# EAGLE design TRI_LED (EAGLE 7.0.0)
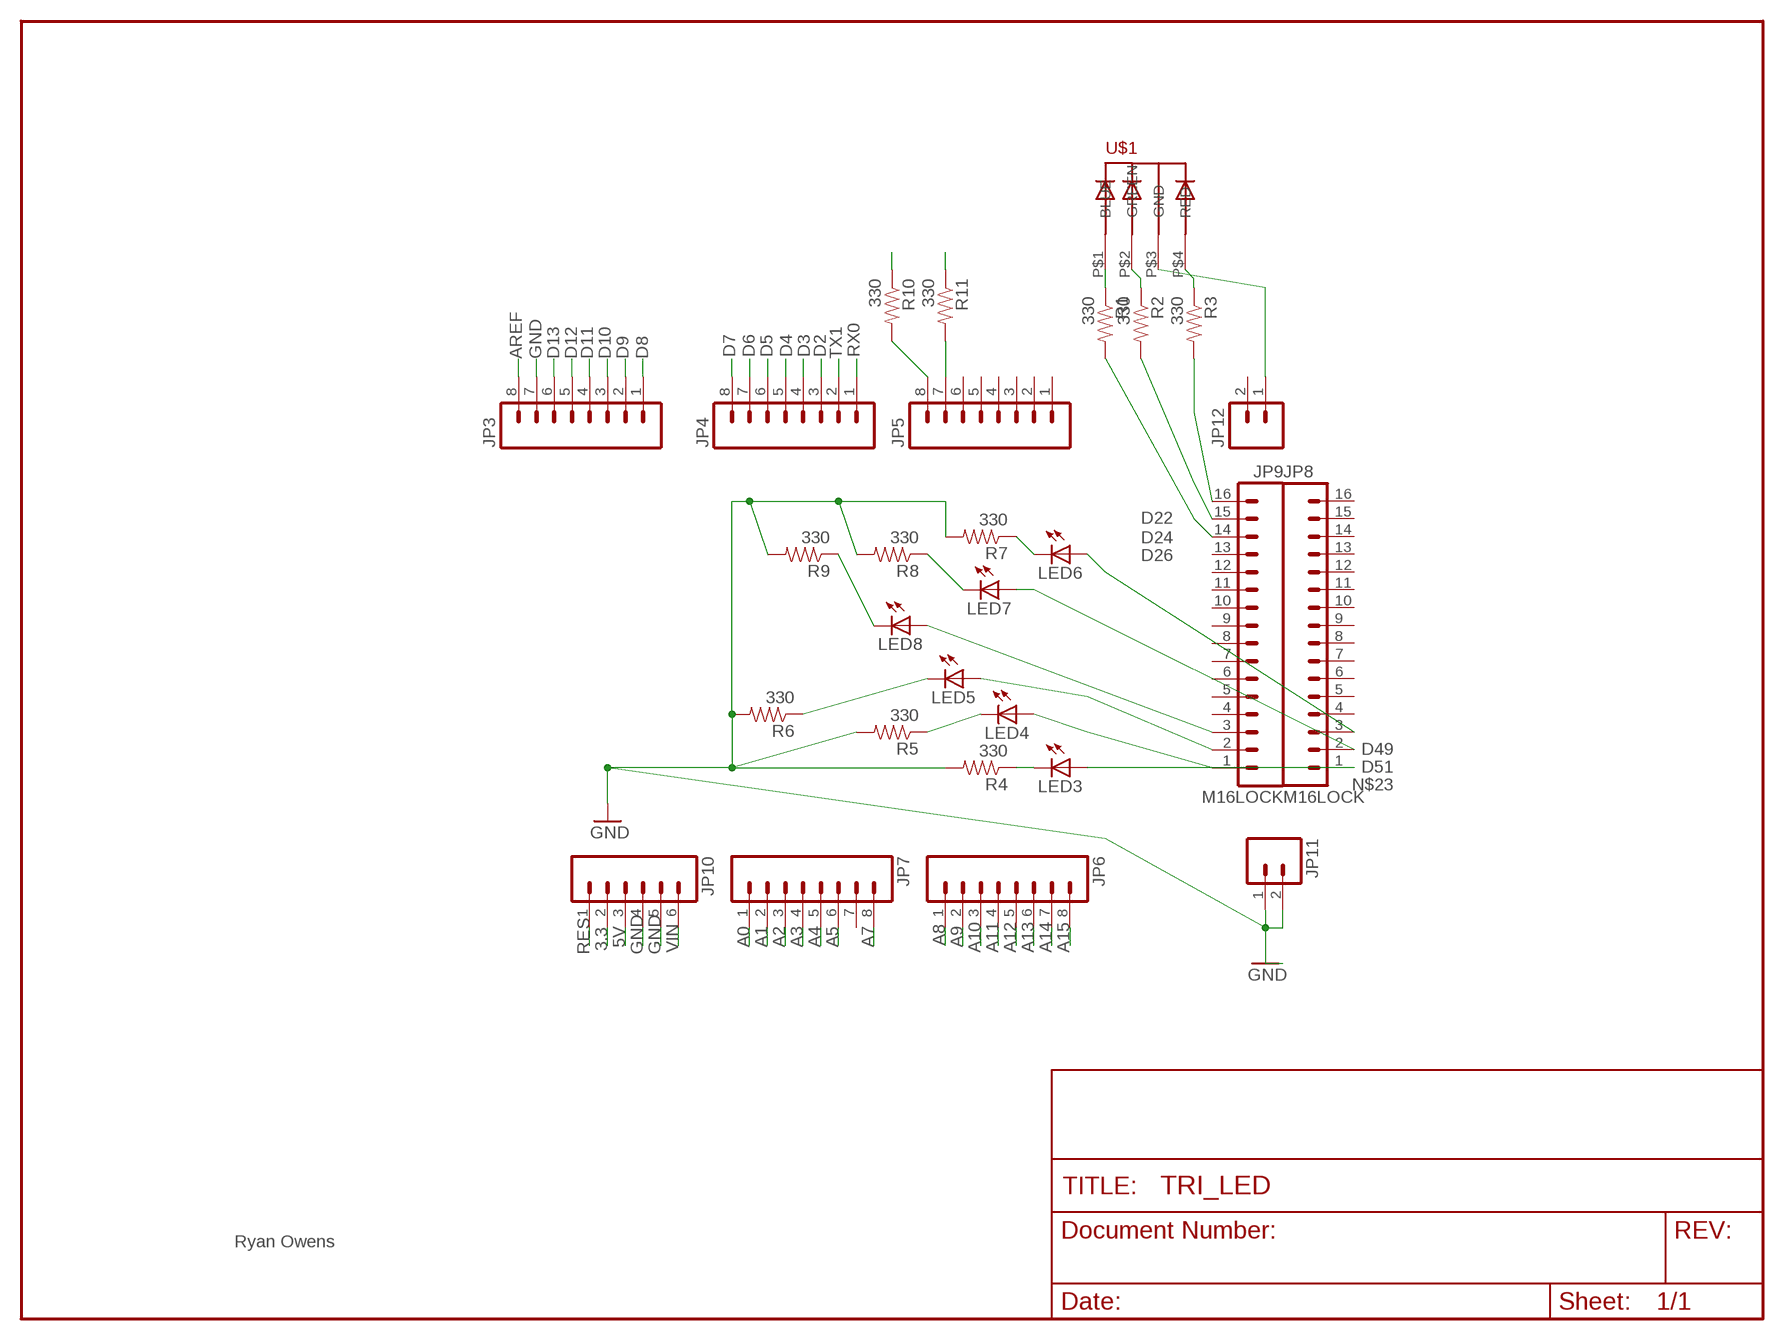
[diagram p0: schematic, sheet 1]

## Parts
JP3  M08LOCK  [1X08_LOCK]
JP4  M08LOCK  [1X08_LOCK]
JP5  M08LOCK  [1X08_LOCK]
JP6  M08LOCK  [1X08_LOCK]
JP7  M08LOCK  [1X08_LOCK]
JP8  M16LOCK  [1X16_LOCK]
JP9  M16LOCK  [1X16_LOCK]
JP10  M06LOCK  [1X06_LOCK]
JP11  M02LOCK  [1X02_LOCK]
JP12  M02LOCK  [1X02_LOCK]
LED3  LED5MM  [LED5MM]
LED4  LED5MM  [LED5MM]
LED5  LED5MM  [LED5MM]
LED6  LED5MM  [LED5MM]
LED7  LED5MM  [LED5MM]
LED8  LED5MM  [LED5MM]
R1  330  RESISTORPTH1  [AXIAL-0.3]
R2  330  RESISTORPTH1  [AXIAL-0.3]
R3  330  RESISTORPTH1  [AXIAL-0.3]
R4  330  RESISTORPTH1  [AXIAL-0.3]
R5  330  RESISTORPTH1  [AXIAL-0.3]
R6  330  RESISTORPTH1  [AXIAL-0.3]
R7  330  RESISTORPTH1  [AXIAL-0.3]
R8  330  RESISTORPTH1  [AXIAL-0.3]
R9  330  RESISTORPTH1  [AXIAL-0.3]
R10  330  RESISTORPTH1  [AXIAL-0.3]
R11  330  RESISTORPTH1  [AXIAL-0.3]
U$1  5MMRGBLED  [LED5MMRGB]

## Nets
3.3: JP10.2
5V: JP10.3
A0: JP7.1
A1: JP7.2
A2: JP7.3
A3: JP7.4
A4: JP7.5
A5: JP7.6
A7: JP7.8
A8: JP6.1
A9: JP6.2
A10: JP6.3
A11: JP6.4
A12: JP6.5
A13: JP6.6
A14: JP6.7
A15: JP6.8
AREF: JP3.8
D2: JP4.3
D3: JP4.4
D4: JP4.5
D5: JP4.6
D6: JP4.7
D7: JP4.8
D8: JP3.1
D9: JP3.2
D10: JP3.3
D11: JP3.4
D12: JP3.5
D13: JP3.6
D22: JP9.1 LED4.A
D24: JP9.2 LED5.A
D26: JP9.3 LED8.A
D49: JP8.3 LED6.A
D51: JP8.2 LED7.A
GND: JP3.7 JP10.4 JP10.5 JP11.1 JP11.2 R4.P$2 R5.P$2 R6.P$2 R7.P$2 R8.P$2 R9.P$2
N$3: LED7.K(C) R8.P$1
N$4: LED6.K(C) R7.P$1
N$7: JP5.8 R10.P$2
N$10: LED8.K(C) R9.P$1
N$11: LED3.K(C) R4.P$1
N$14: JP5.7 R11.P$2
N$15: R11.P$1
N$16: R10.P$1
N$18: R1.P$1 U$1.P$1(BLUE)
N$19: LED4.K(C) R5.P$1
N$20: LED5.K(C) R6.P$1
N$22: R3.P$1 U$1.P$4(RED)
N$23: JP8.1 LED3.A
N$29: R2.P$1 U$1.P$2(GREEN)
N$30: JP12.1 U$1.P$3(GND)
N$31: JP9.14 R1.P$2
N$32: JP9.15 R2.P$2
N$33: JP9.16 R3.P$2
RES: JP10.1
RX0: JP4.1
TX1: JP4.2
VIN: JP10.6
Unconnected: JP5.1 JP5.2 JP5.3 JP5.4 JP5.5 JP5.6 JP7.7 JP8.4 JP8.5 JP8.6 JP8.7 JP8.8 JP8.9 JP8.10 JP8.11 JP8.12 JP8.13 JP8.14 JP8.15 JP8.16 JP9.4 JP9.5 JP9.6 JP9.7 JP9.8 JP9.9 JP9.10 JP9.11 JP9.12 JP9.13 JP12.2

## Notes on the sheet
- Ryan Owens

## Library data of the parts
JP3-JP7 = SparkFun:M08: Header 8 Standard 8-pin 0.1" header. Use with straight break away headers (SKU : PRT-00116), right angle break away headers (PRT-00553), swiss pins (PRT-00743), machine pins (PRT-00117), and female headers (PRT-00115).
JP8 JP9 = SparkFun:M16
JP10 = SparkFun:M06: Header 6 Standard 6-pin 0.1" header. Use with straight break away headers (SKU : PRT-00116), right angle break away headers (PRT-00553), swiss pins (PRT-00743), machine pins (PRT-00117), and female headers (PRT-00115). Molex polarized connector foot print use with SKU : PRT-08094 with associated crimp pins and housings. NOTES ON THE VARIANTS LOCK and LOCK_LONGPADS... This footprint was designed to help hold the alignment of a through-hole component (i.e. 6-pin header) while soldering it into place. You may notice that each hole has been shifted either up or down by 0.005 of an inch from it's more standard position (which is a perfectly straight line). This slight alteration caused the pins (the squares in the middle) to touch the edges of the holes. Because they are alternating, it causes a "brace" to hold the component in place. 0.005 has proven to be the perfect amount of "off-center" position when using our standard breakaway headers. Although looks a little odd when you look at the bare footprint, once you have a header in there, the alteration is very hard to notice. Also, if you push a header all the way into place, it is covered up entirely on the bottom side. This idea of altering the position of holes to aid alignment will be further integrated into the Sparkfun Library for other footprints. It can help hold any component with 3 or more connection pins.
JP11 JP12 = SparkFun:M02: Header 2 Standard 2-pin 0.1" header. Use with straight break away headers (SKU : PRT-00116), right angle break away headers (PRT-00553), swiss pins (PRT-00743), machine pins (PRT-00117), and female headers (PRT-00115). Molex polarized connector foot print use with SKU : PRT-08233 with associated crimp pins and housings.
LED3-LED8 = led:LED: LED OSRAM: - CHIPLED LG R971, LG N971, LY N971, LG Q971, LY Q971, LO R971, LY R971 LH N974, LH R974 LS Q976, LO Q976, LY Q976 LO Q996 - Hyper CHIPLED LW Q18S LB Q993, LB Q99A, LB R99A - SideLED LS A670, LO A670, LY A670, LG A670, LP A670 LB A673, LV A673, LT A673, LW A673 LH A674 LY A675 LS A676, LA A676, LO A676, LY A676, LW A676 LS A679, LY A679, LG A679 - Hyper Micro SIDELED® LS Y876, LA Y876, LO Y876, LY Y876 LT Y87S - SmartLED LW L88C, LW L88S LB L89C, LB L89S, LG L890 LS L89K, LO L89K, LY L89K LS L896, LA L896, LO L896, LY L896 - TOPLED LS T670, LO T670, LY T670, LG T670, LP T670 LSG T670, LSP T670, LSY T670, LOP T670, LYG T670 LG T671, LOG T671, LSG T671 LB T673, LV T673, LT T673, LW T673 LH T674 LS T676, LA T676, LO T676, LY T676, LB T676, LH T676, LSB T676, LW T676 LB T67C, LV T67C, LT T67C, LS T67K, LO T67K, LY T67K, LW E67C LS E67B, LA E67B, LO E67B, LY E67B, LB E67C, LV E67C, LT E67C LW T67C LS T679, LY T679, LG T679 LS T770, LO T770, LY T770, LG T770, LP T770 LB T773, LV T773, LT T773, LW T773 LH T774 LS E675, LA E675, LY E675, LS T675 LS T776, LA T776, LO T776, LY T776, LB T776 LHGB T686 LT T68C, LB T68C - Hyper Mini TOPLED® LB M676 - Mini TOPLED Santana® LG M470 LS M47K, LO M47K, LY M47K Source: http://www.osram.convergy.de LUXEON: - LUMILED® LXK2-PW12-R00, LXK2-PW12-S00, LXK2-PW14-U00, LXK2-PW14-V00 LXK2-PM12-R00, LXK2-PM12-S00, LXK2-PM14-U00 LXK2-PE12-Q00, LXK2-PE12-R00, LXK2-PE12-S00, LXK2-PE14-T00, LXK2-PE14-U00 LXK2-PB12-K00, LXK2-PB12-L00, LXK2-PB12-M00, LXK2-PB14-N00, LXK2-PB14-P00, LXK2-PB14-Q00 LXK2-PR12-L00, LXK2-PR12-M00, LXK2-PR14-Q00, LXK2-PR14-R00 LXK2-PD12-Q00, LXK2-PD12-R00, LXK2-PD12-S00 LXK2-PH12-R00, LXK2-PH12-S00 LXK2-PL12-P00, LXK2-PL12-Q00, LXK2-PL12-R00 Source: www.luxeon.com KINGBRIGHT: KA-3528ASYC Source: www.kingbright.com
R1-R11 = SparkFun:RESISTOR: Resistor Basic schematic elements and footprints for 0603, 1206, and PTH 1/10th watt (small) resistors.
U$1 = led_rgb:5MMRGBLED

## Board
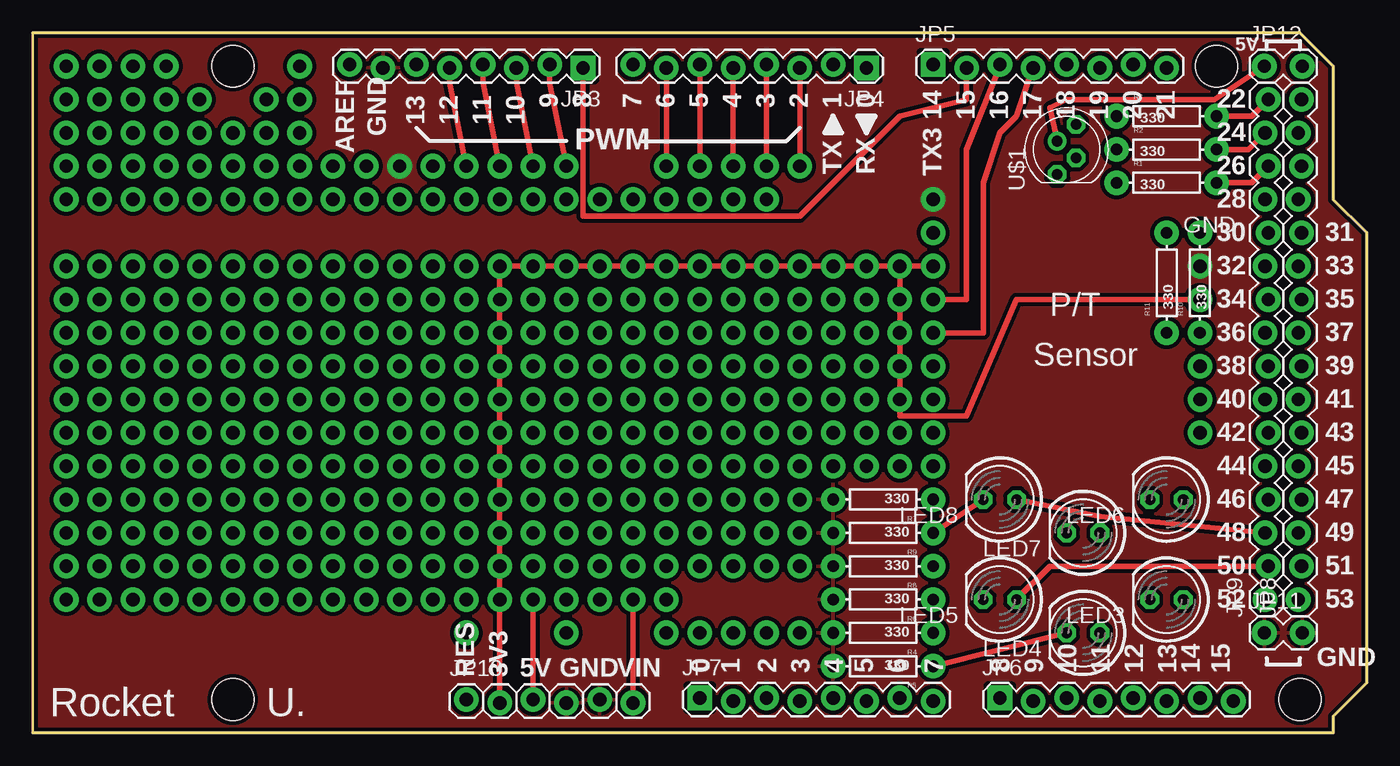
[diagram p1: board, top side]
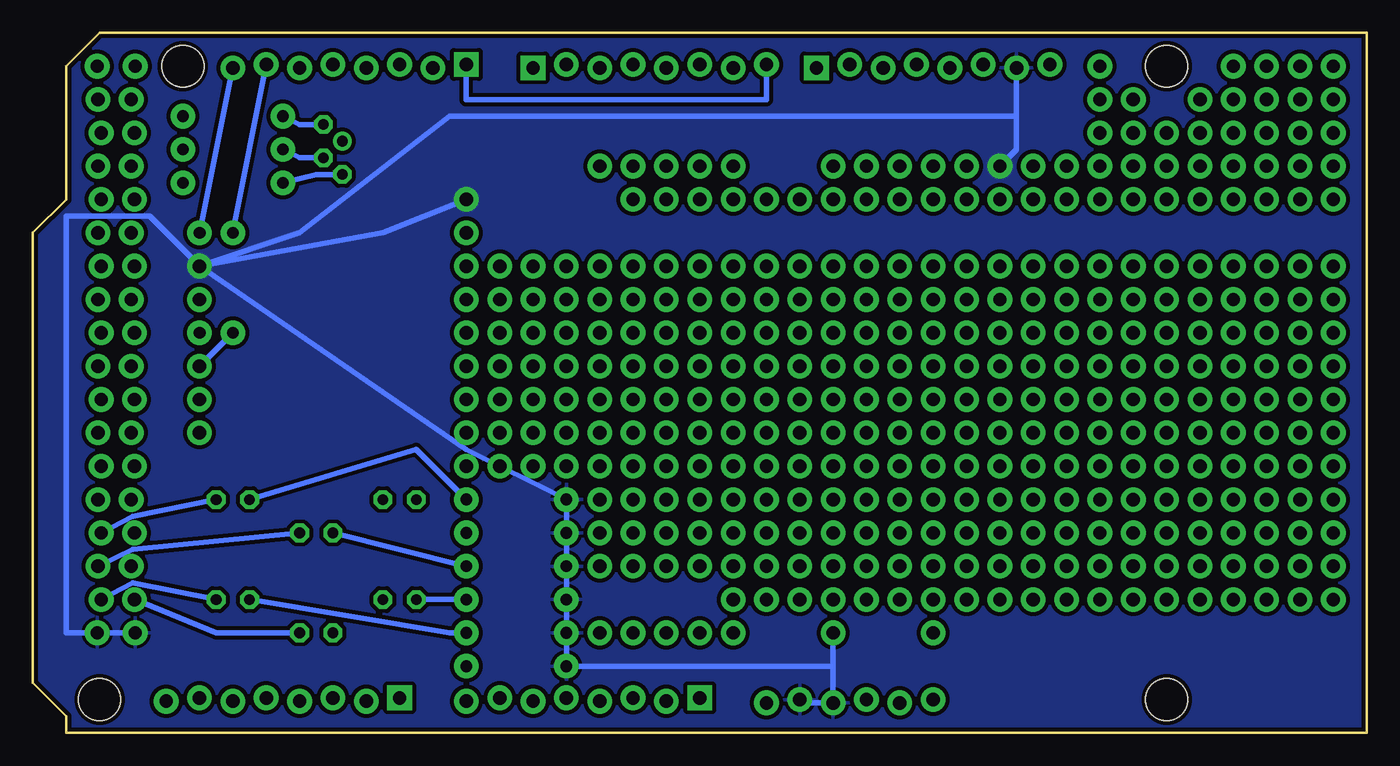
[diagram p2: board, bottom side, seen from below]

Size 101.6 x 53.34 mm. Coordinates in mm from the lower left corner, seen from the top.
Outline: 0,0 99.06,0 99.06,1.27 101.6,3.81 101.6,38.1 99.06,40.64 99.06,50.8 96.52,53.34 0,53.34 0,0
Copper layers (1*16): Top 0.035mm / dielectric 1.5mm / Bottom 0.035mm
Design rules "SparkFun": minimum track width 8mil, minimum drill 20mil, track to track 8mil, track to pad 8mil, pad to pad 8mil, via to via 8mil, smd to smd 8mil, copper to edge 10mil, drill to drill 8mil, minimum pad ring 12mil, minimum via ring 10mil, stop-mask expansion 4mil, vias tented up to drill 25mil, thermal gap 10mil
Holes 3.2 mm at 15.24,50.8 15.24,2.54 90.17,50.8 96.52,2.54

### Footprints (pad centres in the part's own frame; a part is rotated, then mirrored left to right if it is on the bottom)
1X08_LOCK = drill 1.016 pad 1.88 square: 1 0,0.127 | drill 1.016 pad 1.88: 2 2.54,-0.127; 3 5.08,0.127; 4 7.62,-0.127; 5 10.16,0.127; 6 12.7,-0.127; 7 15.24,0.127; 8 17.78,-0.127
1X16_LOCK = drill 1.016 pad 1.88: 1 0,0.127; 2 2.54,-0.127; 3 5.08,0.127; 4 7.62,-0.127; 5 10.16,0.127; 6 12.7,-0.127; 7 15.24,0.127; 8 17.78,-0.127; 9 20.32,0.127; 10 22.86,-0.127; 11 25.4,0.127; 12 27.94,-0.127; 13 30.48,0.127; 14 33.02,-0.127; 15 35.56,0.127; 16 38.1,-0.127
1X06_LOCK = drill 1.016 pad 1.88: 1 0,0; 2 2.54,-0.254; 3 5.08,0; 4 7.62,-0.254; 5 10.16,0; 6 12.7,-0.254
1X02_LOCK = drill 1.016 pad 1.88: 1 -0.178,0; 2 2.718,0
LED5MM = drill 0.813 octagon: A -1.27,0; K 1.27,0
AXIAL-0.3 = drill 0.9 pad 1.88: P$1 -3.81,0; P$2 3.81,0
LED5MMRGB = drill 0.8 pad 0.813 octagon: P$1 -1.905,0.714; P$2 -0.635,-0.714; P$4 1.905,-0.714 | drill 0.8 pad 0.813: P$3 0.635,0.714

### Placement (x,y rotation side)
JP3  41.91,50.8 180 top
JP4  63.5,50.8 180 top
JP5  68.58,50.8 0 top
JP6  73.66,2.54 0 top
JP7  50.8,2.54 0 top
JP8  96.52,10.16 90 top
JP9  93.98,10.16 90 top
JP10  33.02,2.54 0 top
JP11  93.98,7.62 0 top
JP12  93.98,50.8 0 top
LED3  86.36,10.16 180 top
LED4  80.01,7.62 180 top
LED5  73.66,10.16 180 top
LED6  86.36,17.78 180 top
LED7  80.01,15.24 180 top
LED8  73.66,17.78 180 top
R1  86.36,41.91 0 top
R2  86.36,44.45 0 top
R3  86.36,46.99 0 top
R4  64.77,7.62 180 top
R5  64.77,5.08 180 top
R6  64.77,10.16 180 top
R7  64.77,17.78 180 top
R8  64.77,12.7 180 top
R9  64.77,15.24 180 top
R10  88.9,34.29 90 top
R11  86.36,34.29 90 top
U$1  78.74,44.45 90 top

### Tracks (layer width: path | path; a pad name or v marks a point on that pad's centre or on a via)
5V  (via drill 1.02 pad 1.88)
  Top 0.406: JP10.3 v38.1,10.16
A0
  Top 0.203: JP7.1 50.8,2.54
A1
  Top 0.203: JP7.2 53.34,2.54 JP7.2
A2
  Top 0.203: JP7.3 55.88,2.54
A3
  Top 0.203: JP7.4 58.42,2.54 JP7.4
A4
  Top 0.203: JP7.5 60.96,2.54
A5
  Top 0.203: JP7.6 63.5,2.54 JP7.6
A7
  Top 0.203: JP7.8 68.58,2.54 JP7.8
A8
  Top 0.203: JP6.1 73.66,2.54
A9
  Top 0.203: JP6.2 76.2,2.54 JP6.2
A10
  Top 0.203: JP6.3 78.74,2.54
A11
  Top 0.203: JP6.4 81.28,2.54 JP6.4
A12
  Top 0.203: JP6.5 83.82,2.54
A13
  Top 0.203: JP6.6 86.36,2.54 JP6.6
A14
  Top 0.203: JP6.7 88.9,2.54
A15
  Top 0.203: JP6.8 91.44,2.54 JP6.8
AREF
  Top 0.203: JP3.8 24.13,50.8 JP3.8
D2  (via drill 1.02 pad 1.88)
  Top 0.203: JP4.3 58.42,50.8
  Top 0.406: 58.42,50.8 v58.42,43.18
D3  (via drill 1.02 pad 1.88)
  Top 0.203: JP4.4 55.88,50.8
  Top 0.406: 55.88,50.8 v55.88,43.18
D4  (via drill 1.02 pad 1.88)
  Top 0.203: JP4.5 53.34,50.8
  Top 0.406: 53.34,50.8 v53.34,43.18
D5  (via drill 1.02 pad 1.88)
  Top 0.203: JP4.6 50.8,50.8
  Top 0.406: 50.8,50.8 v50.8,43.18
D6  (via drill 1.02 pad 1.88)
  Top 0.203: JP4.7 48.26,50.8
  Top 0.406: 48.26,50.8 v48.26,43.18
D9  (via drill 1.02 pad 1.88)
  Top 0.203: JP3.2 39.37,50.8
  Top 0.406: 39.37,50.8 39.37,49.53 v40.64,43.18
D10  (via drill 1.02 pad 1.88)
  Top 0.203: JP3.3 36.83,50.8
  Top 0.406: 36.83,50.8 36.83,49.53 v38.1,43.18
D11  (via drill 1.02 pad 1.88)
  Top 0.203: JP3.4 34.29,50.8
  Top 0.406: 34.29,50.8 34.29,49.53 v35.56,43.18
D12  (via drill 1.02 pad 1.88)
  Top 0.203: JP3.5 31.75,50.8
  Top 0.406: 31.75,50.8 31.75,49.53 v33.02,43.18
D22
  Bottom 0.406: JP9.1 87.63,7.62 LED4.A
D24
  Top 0.406: JP9.2 77.47,12.7 LED5.A
D26
  Top 0.406: JP9.3 81.28,16.51 LED8.A
D49
  Bottom 0.406: JP8.3 93.98,16.51 LED6.A
D51
  Bottom 0.406: JP8.2 93.98,13.97 LED7.A
GND  (via drill 1.02 pad 1.88)
  Bottom 0.406: JP10.5 43.18,2.29 JP10.4 40.64,5.08 | JP11.1 JP11.2 99.06,7.62 99.06,39.37 92.71,39.37 v88.9,35.56 | v88.9,35.56 81.28,38.1 69.85,46.99 26.67,46.99 JP3.7 26.67,44.45 v27.94,43.18 | v88.9,35.56 68.58,21.59 R7.P$2 R9.P$2 R8.P$2 R6.P$2 R4.P$2 R5.P$2 40.64,5.08 | v88.9,35.56 74.93,38.1 v68.58,40.64 | 40.64,5.08 40.64,7.62
  pour Bottom (isolate 0.305): 0,0 99.06,0 99.06,1.27 101.6,3.81 101.6,38.1 99.06,40.64 99.06,50.8 96.52,53.34 0,53.34 0,2.54
  pour Top (isolate 0.305): 0,0 99.06,0 99.06,1.27 101.6,3.81 101.6,38.1 99.06,40.64 99.06,50.8 96.52,53.34 0,53.34 0,2.54
N$1  (via drill 1.02 pad 1.88)
  other vias: 27.94,12.7
N$2
  Bottom 0.406: 45.72,50.8 45.72,48.26 68.58,48.26 68.58,50.8
N$3
  Bottom 0.406: LED7.K R8.P$1
N$4
  Bottom 0.406: LED6.K 72.39,21.59 R7.P$1
N$5  (via drill 1.02 pad 1.88)
  other vias: 88.9,25.4
N$7
  Bottom 0.406: JP5.8 R10.P$2
N$10
  Top 0.406: LED8.K R9.P$1
N$11
  Bottom 0.406: LED3.K 69.85,7.62 R4.P$1
N$12  (via drill 1.02 pad 1.88)
  other vias: 30.48,12.7
N$13  (via drill 1.02 pad 1.88)
  other vias: 2.54,10.16
N$14
  Bottom 0.406: JP5.7 R11.P$2
N$15  (via drill 1.02 pad 1.88)
  Bottom 0.406: v88.9,27.94 R11.P$1
N$17
  Top 0.406: 41.91,50.8 41.91,39.37 58.42,39.37 66.04,46.99 71.12,48.26 71.12,50.8
N$18
  Bottom 0.406: U$1.P$1 80.01,42.55 R1.P$1
N$19
  Top 0.406: LED4.K R5.P$1
N$20
  Bottom 0.406: LED5.K R6.P$1
N$21  (via drill 1.02 pad 1.88)
  other vias: 25.4,10.16
N$22
  Bottom 0.406: U$1.P$4 81.28,46.35 R3.P$1
N$23
  Bottom 0.406: JP8.1 93.98,11.43 LED3.A
N$24  (via drill 1.02 pad 1.88)
  other vias: 5.08,10.16
N$25  (via drill 1.02 pad 1.88)
  other vias: 7.62,10.16
N$26  (via drill 1.02 pad 1.88)
  other vias: 27.94,10.16
N$27  (via drill 1.02 pad 1.88)
  other vias: 30.48,10.16
N$28  (via drill 1.02 pad 1.88)
  other vias: 33.02,10.16
N$29
  Bottom 0.406: U$1.P$2 81.28,43.81 R2.P$1
N$30
  Top 0.406: U$1.P$3 77.47,47.62 78.74,48.26 89.99,48.26 JP12.1
N$31
  Top 0.406: R1.P$2 92.84,41.91 JP9.14
N$32
  Top 0.406: R2.P$2 92.58,44.45 JP9.15
N$33
  Top 0.406: R3.P$2 92.84,46.99 JP9.16
N$36  (via drill 1.02 pad 1.88)
  other vias: 10.16,10.16
N$37  (via drill 1.02 pad 1.88)
  other vias: 12.7,10.16
N$86  (via drill 1.02 pad 1.88)
  Top 0.406: 76.2,50.8 74.93,46.99 73.66,45.72 72.39,41.91 72.39,30.48 v68.58,30.48
N$103  (via drill 1.02 pad 1.88)
  other vias: 66.04,25.4 88.9,22.86 66.04,22.86 66.04,20.32 68.58,22.86 68.58,25.4 68.58,20.32
N$104  (via drill 1.02 pad 1.88)
  other vias: 66.04,27.94
N$105  (via drill 1.02 pad 1.88)
  other vias: 66.04,30.48
N$107  (via drill 1.02 pad 1.88)
  other vias: 66.04,35.56
N$110  (via drill 1.02 pad 1.88)
  other vias: 63.5,35.56
N$112  (via drill 1.02 pad 1.88)
  other vias: 63.5,30.48
N$113  (via drill 1.02 pad 1.88)
  other vias: 63.5,27.94
N$114  (via drill 1.02 pad 1.88)
  other vias: 63.5,25.4 63.5,22.86 63.5,20.32
N$130  (via drill 1.02 pad 1.88)
  other vias: 60.96,25.4 60.96,22.86 60.96,20.32
N$131  (via drill 1.02 pad 1.88)
  other vias: 60.96,27.94
N$132  (via drill 1.02 pad 1.88)
  other vias: 60.96,30.48
N$133  (via drill 1.02 pad 1.88)
  other vias: 60.96,33.02 63.5,33.02 66.04,33.02
N$134  (via drill 1.02 pad 1.88)
  other vias: 60.96,35.56
N$139  (via drill 1.02 pad 1.88)
  other vias: 58.42,35.56
N$140  (via drill 1.02 pad 1.88)
  other vias: 58.42,33.02
N$141  (via drill 1.02 pad 1.88)
  other vias: 58.42,30.48
N$142  (via drill 1.02 pad 1.88)
  other vias: 58.42,27.94
N$143  (via drill 1.02 pad 1.88)
  other vias: 58.42,25.4
N$144  (via drill 1.02 pad 1.88)
  other vias: 58.42,22.86
N$145  (via drill 1.02 pad 1.88)
  other vias: 58.42,20.32
N$146  (via drill 1.02 pad 1.88)
  other vias: 58.42,17.78
N$152  (via drill 1.02 pad 1.88)
  other vias: 55.88,15.24 55.88,12.7
N$153  (via drill 1.02 pad 1.88)
  other vias: 55.88,17.78
N$154  (via drill 1.02 pad 1.88)
  other vias: 55.88,20.32
N$155  (via drill 1.02 pad 1.88)
  other vias: 55.88,22.86
N$156  (via drill 1.02 pad 1.88)
  other vias: 55.88,25.4
N$157  (via drill 1.02 pad 1.88)
  other vias: 55.88,27.94
N$158  (via drill 1.02 pad 1.88)
  other vias: 55.88,30.48
N$159  (via drill 1.02 pad 1.88)
  other vias: 55.88,33.02
N$160  (via drill 1.02 pad 1.88)
  other vias: 55.88,35.56
N$162  (via drill 1.02 pad 1.88)
  other vias: 55.88,40.64
N$165  (via drill 1.02 pad 1.88)
  other vias: 53.34,40.64
N$167  (via drill 1.02 pad 1.88)
  other vias: 53.34,35.56
N$168  (via drill 1.02 pad 1.88)
  other vias: 53.34,33.02
N$169  (via drill 1.02 pad 1.88)
  other vias: 53.34,30.48 53.34,27.94
N$171  (via drill 1.02 pad 1.88)
  other vias: 53.34,25.4
N$172  (via drill 1.02 pad 1.88)
  other vias: 53.34,22.86
N$173  (via drill 1.02 pad 1.88)
  other vias: 53.34,20.32
N$174  (via drill 1.02 pad 1.88)
  other vias: 53.34,17.78
N$175  (via drill 1.02 pad 1.88)
  other vias: 53.34,15.24 53.34,12.7
N$180  (via drill 1.02 pad 1.88)
  other vias: 50.8,15.24 50.8,12.7
N$181  (via drill 1.02 pad 1.88)
  other vias: 50.8,17.78
N$182  (via drill 1.02 pad 1.88)
  other vias: 50.8,20.32
N$183  (via drill 1.02 pad 1.88)
  other vias: 50.8,22.86
N$184  (via drill 1.02 pad 1.88)
  other vias: 50.8,25.4
N$186  (via drill 1.02 pad 1.88)
  other vias: 50.8,30.48 48.26,30.48 50.8,27.94
N$187  (via drill 1.02 pad 1.88)
  other vias: 50.8,33.02
N$188  (via drill 1.02 pad 1.88)
  other vias: 50.8,35.56
N$190  (via drill 1.02 pad 1.88)
  other vias: 50.8,40.64
N$193  (via drill 1.02 pad 1.88)
  other vias: 48.26,40.64
N$195  (via drill 1.02 pad 1.88)
  other vias: 48.26,35.56
N$196  (via drill 1.02 pad 1.88)
  other vias: 48.26,33.02
N$198  (via drill 1.02 pad 1.88)
  other vias: 48.26,27.94
N$199  (via drill 1.02 pad 1.88)
  other vias: 48.26,25.4
N$200  (via drill 1.02 pad 1.88)
  other vias: 48.26,22.86
N$201  (via drill 1.02 pad 1.88)
  other vias: 48.26,20.32
N$202  (via drill 1.02 pad 1.88)
  other vias: 48.26,17.78
N$203  (via drill 1.02 pad 1.88)
  other vias: 48.26,15.24 48.26,12.7
N$208  (via drill 1.02 pad 1.88)
  other vias: 45.72,15.24 45.72,12.7
N$209  (via drill 1.02 pad 1.88)
  other vias: 45.72,17.78
N$210  (via drill 1.02 pad 1.88)
  other vias: 45.72,20.32
N$211  (via drill 1.02 pad 1.88)
  other vias: 45.72,22.86
N$212  (via drill 1.02 pad 1.88)
  other vias: 45.72,25.4
N$213  (via drill 1.02 pad 1.88)
  other vias: 45.72,27.94
N$214  (via drill 1.02 pad 1.88)
  other vias: 45.72,30.48
N$215  (via drill 1.02 pad 1.88)
  other vias: 45.72,33.02
N$216  (via drill 1.02 pad 1.88)
  other vias: 45.72,35.56
N$218  (via drill 1.02 pad 1.88)
  other vias: 45.72,40.64
N$221  (via drill 1.02 pad 1.88)
  other vias: 43.18,40.64
N$223  (via drill 1.02 pad 1.88)
  other vias: 43.18,35.56
N$224  (via drill 1.02 pad 1.88)
  other vias: 43.18,33.02
N$225  (via drill 1.02 pad 1.88)
  other vias: 43.18,30.48
N$226  (via drill 1.02 pad 1.88)
  other vias: 43.18,27.94
N$227  (via drill 1.02 pad 1.88)
  other vias: 43.18,25.4
N$228  (via drill 1.02 pad 1.88)
  other vias: 43.18,22.86
N$229  (via drill 1.02 pad 1.88)
  other vias: 43.18,20.32
N$230  (via drill 1.02 pad 1.88)
  other vias: 43.18,17.78
N$231  (via drill 1.02 pad 1.88)
  other vias: 43.18,15.24 43.18,12.7
N$235  (via drill 1.02 pad 1.88)
  other vias: 40.64,7.62
N$236  (via drill 1.02 pad 1.88)
  other vias: 40.64,15.24 40.64,12.7 40.64,10.16
N$237  (via drill 1.02 pad 1.88)
  other vias: 40.64,17.78
N$238  (via drill 1.02 pad 1.88)
  other vias: 40.64,20.32
N$239  (via drill 1.02 pad 1.88)
  other vias: 40.64,22.86
N$240  (via drill 1.02 pad 1.88)
  other vias: 40.64,25.4
N$242  (via drill 1.02 pad 1.88)
  other vias: 40.64,30.48 40.64,27.94
N$243  (via drill 1.02 pad 1.88)
  other vias: 40.64,33.02
N$244  (via drill 1.02 pad 1.88)
  other vias: 40.64,35.56
N$246  (via drill 1.02 pad 1.88)
  other vias: 40.64,40.64
N$249  (via drill 1.02 pad 1.88)
  other vias: 38.1,40.64
N$251  (via drill 1.02 pad 1.88)
  other vias: 38.1,35.56
N$252  (via drill 1.02 pad 1.88)
  other vias: 38.1,33.02
N$253  (via drill 1.02 pad 1.88)
  other vias: 38.1,30.48
N$254  (via drill 1.02 pad 1.88)
  other vias: 38.1,27.94
N$255  (via drill 1.02 pad 1.88)
  other vias: 38.1,25.4
N$256  (via drill 1.02 pad 1.88)
  other vias: 38.1,22.86
N$257  (via drill 1.02 pad 1.88)
  other vias: 38.1,20.32
N$258  (via drill 1.02 pad 1.88)
  other vias: 38.1,17.78
N$265  (via drill 1.02 pad 1.88)
  other vias: 35.56,17.78
N$266  (via drill 1.02 pad 1.88)
  other vias: 35.56,20.32
N$267  (via drill 1.02 pad 1.88)
  other vias: 35.56,22.86
N$268  (via drill 1.02 pad 1.88)
  other vias: 35.56,25.4
N$269  (via drill 1.02 pad 1.88)
  other vias: 35.56,27.94
N$270  (via drill 1.02 pad 1.88)
  other vias: 35.56,30.48
N$271  (via drill 1.02 pad 1.88)
  Top 0.406: 35.56,2.54 v35.56,10.16 v35.56,12.7 v35.56,15.24 v35.56,33.02 v35.56,35.56 v68.58,35.56 66.04,35.56 66.04,24.13 71.12,24.13 74.93,33.02 v88.9,33.02
N$274  (via drill 1.02 pad 1.88)
  other vias: 35.56,40.64
N$277  (via drill 1.02 pad 1.88)
  other vias: 33.02,40.64
N$279  (via drill 1.02 pad 1.88)
  other vias: 33.02,35.56
N$280  (via drill 1.02 pad 1.88)
  other vias: 33.02,33.02
N$281  (via drill 1.02 pad 1.88)
  other vias: 33.02,30.48
N$282  (via drill 1.02 pad 1.88)
  other vias: 33.02,27.94
N$283  (via drill 1.02 pad 1.88)
  other vias: 33.02,22.86
N$284  (via drill 1.02 pad 1.88)
  other vias: 33.02,25.4
N$285  (via drill 1.02 pad 1.88)
  other vias: 33.02,20.32
N$286  (via drill 1.02 pad 1.88)
  other vias: 33.02,17.78
N$287  (via drill 1.02 pad 1.88)
  other vias: 33.02,15.24
N$288  (via drill 1.02 pad 1.88)
  other vias: 33.02,12.7
N$292  (via drill 1.02 pad 1.88)
  other vias: 30.48,15.24
N$293  (via drill 1.02 pad 1.88)
  other vias: 30.48,17.78
N$294  (via drill 1.02 pad 1.88)
  other vias: 30.48,20.32
N$295  (via drill 1.02 pad 1.88)
  other vias: 30.48,22.86
N$296  (via drill 1.02 pad 1.88)
  other vias: 30.48,25.4
N$297  (via drill 1.02 pad 1.88)
  other vias: 30.48,27.94
N$298  (via drill 1.02 pad 1.88)
  other vias: 30.48,30.48
N$299  (via drill 1.02 pad 1.88)
  other vias: 30.48,33.02
N$300  (via drill 1.02 pad 1.88)
  other vias: 30.48,35.56
N$302  (via drill 1.02 pad 1.88)
  other vias: 30.48,40.64
N$303  (via drill 1.02 pad 1.88)
  other vias: 30.48,43.18
N$304  (via drill 1.02 pad 1.88)
  other vias: 10.16,22.86
N$305  (via drill 1.02 pad 1.88)
  other vias: 27.94,40.64
N$307  (via drill 1.02 pad 1.88)
  other vias: 27.94,35.56
N$308  (via drill 1.02 pad 1.88)
  other vias: 27.94,33.02
N$309  (via drill 1.02 pad 1.88)
  other vias: 27.94,30.48
N$310  (via drill 1.02 pad 1.88)
  other vias: 27.94,27.94
N$311  (via drill 1.02 pad 1.88)
  other vias: 27.94,25.4
N$312  (via drill 1.02 pad 1.88)
  other vias: 27.94,20.32
N$313  (via drill 1.02 pad 1.88)
  other vias: 27.94,15.24
N$319  (via drill 1.02 pad 1.88)
  other vias: 33.02,7.62
N$324  (via drill 1.02 pad 1.88)
  other vias: 27.94,17.78
N$325  (via drill 1.02 pad 1.88)
  other vias: 27.94,22.86
N$326  (via drill 1.02 pad 1.88)
  other vias: 25.4,43.18
N$327  (via drill 1.02 pad 1.88)
  other vias: 25.4,40.64
N$329  (via drill 1.02 pad 1.88)
  other vias: 25.4,35.56
N$330  (via drill 1.02 pad 1.88)
  other vias: 25.4,33.02
N$331  (via drill 1.02 pad 1.88)
  other vias: 25.4,30.48
N$332  (via drill 1.02 pad 1.88)
  other vias: 25.4,27.94
N$333  (via drill 1.02 pad 1.88)
  other vias: 25.4,25.4
N$334  (via drill 1.02 pad 1.88)
  other vias: 25.4,22.86
N$335  (via drill 1.02 pad 1.88)
  other vias: 25.4,20.32
N$336  (via drill 1.02 pad 1.88)
  other vias: 25.4,17.78
N$337  (via drill 1.02 pad 1.88)
  other vias: 25.4,15.24
N$338  (via drill 1.02 pad 1.88)
  other vias: 25.4,12.7
N$343  (via drill 1.02 pad 1.88)
  other vias: 22.86,12.7
N$344  (via drill 1.02 pad 1.88)
  other vias: 22.86,15.24
N$345  (via drill 1.02 pad 1.88)
  other vias: 22.86,17.78
N$346  (via drill 1.02 pad 1.88)
  other vias: 22.86,20.32
N$347  (via drill 1.02 pad 1.88)
  other vias: 22.86,22.86
N$348  (via drill 1.02 pad 1.88)
  other vias: 22.86,25.4
N$349  (via drill 1.02 pad 1.88)
  other vias: 22.86,27.94
N$350  (via drill 1.02 pad 1.88)
  other vias: 22.86,30.48
N$351  (via drill 1.02 pad 1.88)
  other vias: 22.86,33.02
N$352  (via drill 1.02 pad 1.88)
  other vias: 22.86,35.56
N$354  (via drill 1.02 pad 1.88)
  other vias: 22.86,40.64
N$355  (via drill 1.02 pad 1.88)
  other vias: 22.86,43.18
N$356  (via drill 1.02 pad 1.88)
  other vias: 20.32,45.72
N$357  (via drill 1.02 pad 1.88)
  other vias: 20.32,48.26
N$358  (via drill 1.02 pad 1.88)
  other vias: 20.32,50.8
N$359  (via drill 1.02 pad 1.88)
  other vias: 20.32,43.18
N$360  (via drill 1.02 pad 1.88)
  other vias: 20.32,40.64
N$362  (via drill 1.02 pad 1.88)
  other vias: 20.32,35.56
N$363  (via drill 1.02 pad 1.88)
  other vias: 20.32,33.02
N$364  (via drill 1.02 pad 1.88)
  other vias: 20.32,30.48
N$365  (via drill 1.02 pad 1.88)
  other vias: 20.32,27.94
N$366  (via drill 1.02 pad 1.88)
  other vias: 20.32,22.86
N$367  (via drill 1.02 pad 1.88)
  other vias: 20.32,25.4
N$368  (via drill 1.02 pad 1.88)
  other vias: 20.32,20.32
N$369  (via drill 1.02 pad 1.88)
  other vias: 20.32,17.78
N$370  (via drill 1.02 pad 1.88)
  other vias: 20.32,15.24
N$371  (via drill 1.02 pad 1.88)
  other vias: 20.32,12.7
N$376  (via drill 1.02 pad 1.88)
  other vias: 17.78,12.7
N$377  (via drill 1.02 pad 1.88)
  other vias: 17.78,15.24
N$378  (via drill 1.02 pad 1.88)
  other vias: 17.78,17.78
N$379  (via drill 1.02 pad 1.88)
  other vias: 17.78,20.32
N$380  (via drill 1.02 pad 1.88)
  other vias: 17.78,22.86
N$381  (via drill 1.02 pad 1.88)
  other vias: 17.78,25.4
N$382  (via drill 1.02 pad 1.88)
  other vias: 17.78,27.94
N$383  (via drill 1.02 pad 1.88)
  other vias: 17.78,30.48
N$384  (via drill 1.02 pad 1.88)
  other vias: 17.78,33.02
N$385  (via drill 1.02 pad 1.88)
  other vias: 17.78,35.56
N$387  (via drill 1.02 pad 1.88)
  other vias: 17.78,40.64
N$388  (via drill 1.02 pad 1.88)
  other vias: 17.78,43.18
N$389  (via drill 1.02 pad 1.88)
  other vias: 17.78,45.72
N$390  (via drill 1.02 pad 1.88)
  other vias: 15.24,45.72
N$391  (via drill 1.02 pad 1.88)
  other vias: 12.7,45.72
N$392  (via drill 1.02 pad 1.88)
  other vias: 10.16,45.72
N$393  (via drill 1.02 pad 1.88)
  other vias: 7.62,45.72
N$394  (via drill 1.02 pad 1.88)
  other vias: 5.08,45.72
N$395  (via drill 1.02 pad 1.88)
  other vias: 5.08,43.18
N$397  (via drill 1.02 pad 1.88)
  other vias: 5.08,40.64
N$398  (via drill 1.02 pad 1.88)
  other vias: 5.08,35.56 2.54,35.56
N$399  (via drill 1.02 pad 1.88)
  other vias: 5.08,33.02 2.54,33.02
N$400  (via drill 1.02 pad 1.88)
  other vias: 5.08,30.48 5.08,27.94 2.54,27.94 2.54,30.48
N$401  (via drill 1.02 pad 1.88)
  other vias: 7.62,30.48
N$402  (via drill 1.02 pad 1.88)
  other vias: 7.62,33.02
N$403  (via drill 1.02 pad 1.88)
  other vias: 7.62,35.56
N$405  (via drill 1.02 pad 1.88)
  other vias: 7.62,40.64
N$406  (via drill 1.02 pad 1.88)
  other vias: 7.62,43.18
N$407  (via drill 1.02 pad 1.88)
  other vias: 10.16,43.18
N$408  (via drill 1.02 pad 1.88)
  other vias: 10.16,40.64
N$410  (via drill 1.02 pad 1.88)
  other vias: 10.16,35.56
N$411  (via drill 1.02 pad 1.88)
  other vias: 10.16,33.02
N$413  (via drill 1.02 pad 1.88)
  other vias: 12.7,30.48
N$414  (via drill 1.02 pad 1.88)
  other vias: 12.7,33.02
N$415  (via drill 1.02 pad 1.88)
  other vias: 12.7,35.56
N$417  (via drill 1.02 pad 1.88)
  other vias: 12.7,40.64
N$418  (via drill 1.02 pad 1.88)
  other vias: 12.7,43.18
N$419  (via drill 1.02 pad 1.88)
  other vias: 15.24,43.18
N$420  (via drill 1.02 pad 1.88)
  other vias: 15.24,40.64
N$422  (via drill 1.02 pad 1.88)
  other vias: 15.24,35.56
N$423  (via drill 1.02 pad 1.88)
  other vias: 15.24,33.02
N$424  (via drill 1.02 pad 1.88)
  other vias: 15.24,30.48
N$425  (via drill 1.02 pad 1.88)
  other vias: 15.24,27.94
N$426  (via drill 1.02 pad 1.88)
  other vias: 15.24,25.4 68.58,27.94
N$427  (via drill 1.02 pad 1.88)
  other vias: 15.24,22.86
N$428  (via drill 1.02 pad 1.88)
  other vias: 15.24,20.32
N$429  (via drill 1.02 pad 1.88)
  other vias: 15.24,17.78
N$430  (via drill 1.02 pad 1.88)
  other vias: 15.24,12.7
N$431  (via drill 1.02 pad 1.88)
  other vias: 15.24,15.24
N$436  (via drill 1.02 pad 1.88)
  other vias: 12.7,12.7
N$437  (via drill 1.02 pad 1.88)
  other vias: 12.7,15.24
N$438  (via drill 1.02 pad 1.88)
  other vias: 12.7,20.32
N$439  (via drill 1.02 pad 1.88)
  other vias: 12.7,17.78
N$440  (via drill 1.02 pad 1.88)
  other vias: 12.7,22.86
N$441  (via drill 1.02 pad 1.88)
  other vias: 12.7,25.4
N$442  (via drill 1.02 pad 1.88)
  Top 0.406: v68.58,33.02 71.12,33.02 71.12,44.45 73.66,50.8
  other vias: 12.7,27.94 38.1,12.7
N$443  (via drill 1.02 pad 1.88)
  other vias: 10.16,27.94 10.16,30.48
N$444  (via drill 1.02 pad 1.88)
  other vias: 7.62,25.4
N$445  (via drill 1.02 pad 1.88)
  other vias: 10.16,25.4 68.58,38.1 38.1,15.24
N$447  (via drill 1.02 pad 1.88)
  other vias: 7.62,22.86
N$448  (via drill 1.02 pad 1.88)
  other vias: 5.08,22.86 2.54,22.86
N$449  (via drill 1.02 pad 1.88)
  other vias: 5.08,20.32 2.54,20.32
N$450  (via drill 1.02 pad 1.88)
  other vias: 5.08,17.78 2.54,17.78
N$451  (via drill 1.02 pad 1.88)
  other vias: 5.08,15.24
N$452  (via drill 1.02 pad 1.88)
  other vias: 5.08,12.7
N$460  (via drill 1.02 pad 1.88)
  other vias: 10.16,12.7
N$461  (via drill 1.02 pad 1.88)
  other vias: 10.16,15.24
N$462  (via drill 1.02 pad 1.88)
  other vias: 10.16,17.78
N$463  (via drill 1.02 pad 1.88)
  other vias: 10.16,20.32
N$464  (via drill 1.02 pad 1.88)
  other vias: 7.62,20.32 17.78,10.16
N$465  (via drill 1.02 pad 1.88)
  other vias: 7.62,17.78
N$466  (via drill 1.02 pad 1.88)
  other vias: 7.62,12.7
N$467  (via drill 1.02 pad 1.88)
  other vias: 7.62,15.24 15.24,10.16 20.32,10.16 22.86,10.16
N$477  (via drill 1.02 pad 1.88)
  other vias: 12.7,48.26
N$478  (via drill 1.02 pad 1.88)
  other vias: 10.16,48.26
N$479  (via drill 1.02 pad 1.88)
  other vias: 7.62,48.26
N$480  (via drill 1.02 pad 1.88)
  other vias: 5.08,48.26
N$481  (via drill 1.02 pad 1.88)
  other vias: 5.08,50.8
N$482  (via drill 1.02 pad 1.88)
  other vias: 7.62,50.8
N$483  (via drill 1.02 pad 1.88)
  other vias: 10.16,50.8
N$484  (via drill 1.02 pad 1.88)
  other vias: 17.78,48.26
N$492  (via drill 1.02 pad 1.88)
  other vias: 2.54,12.7
N$493  (via drill 1.02 pad 1.88)
  other vias: 2.54,15.24
N$495  (via drill 1.02 pad 1.88)
  other vias: 2.54,43.18
N$496  (via drill 1.02 pad 1.88)
  other vias: 2.54,40.64
N$497  (via drill 1.02 pad 1.88)
  other vias: 2.54,45.72
N$498  (via drill 1.02 pad 1.88)
  other vias: 2.54,48.26
N$499  (via drill 1.02 pad 1.88)
  other vias: 2.54,50.8
N$500  (via drill 1.02 pad 1.88)
  other vias: 7.62,27.94
N$501  (via drill 1.02 pad 1.88)
  other vias: 5.08,25.4 2.54,25.4
RX0
  Top 0.203: JP4.1 63.5,50.8
TX1
  Top 0.203: JP4.2 60.96,50.8 JP4.2
VIN  (via drill 1.02 pad 1.88)
  Top 0.203: JP10.6 45.72,2.54
  Top 0.406: 45.72,2.54 v45.72,10.16
  other vias: 58.42,15.24 58.42,12.7 58.42,7.62 55.88,7.62 53.34,7.62 50.8,7.62 48.26,10.16 43.18,10.16 48.26,7.62

### Text on the board
tPlace: 5V | 9 | 8 | 7 | 6 | 5 | 4 | 3 | 2 | 1 | 0 | 22 | 14 | 15 | 16 | 17 | 18 | 19 | 20 | 21 | 13 | 12 | 11 | 10 | GND | 24 | AREF | PWM | TX | RX | 26 | TX3 | 28 | GND | 30 | 31 | 32 | 33 | P/T | 34 | 35 | 36 | 37 | Sensor | 38 | 39 | 40 | 41 | 42 | 43 | 44 | 45 | 46 | 47 | 48 | 49 | 50 | 51 | 52 | 53 | 0 | 1 | 2 | 3 | 4 | 5 | 6 | 7 | 8 | 9 | 10 | 11 | 12 | 13 | 14 | 15 | GND | RES | 3V3 | 5V | GND | VIN | Rocket | U.